# Altium schematic sheet MCU_and_Peripheral_Circuits.SchDoc: MCU & Peripheral Circuits
size 292 x 193 mm; SheetNumber: 7; SheetTotal: 12; SheetSize: A4
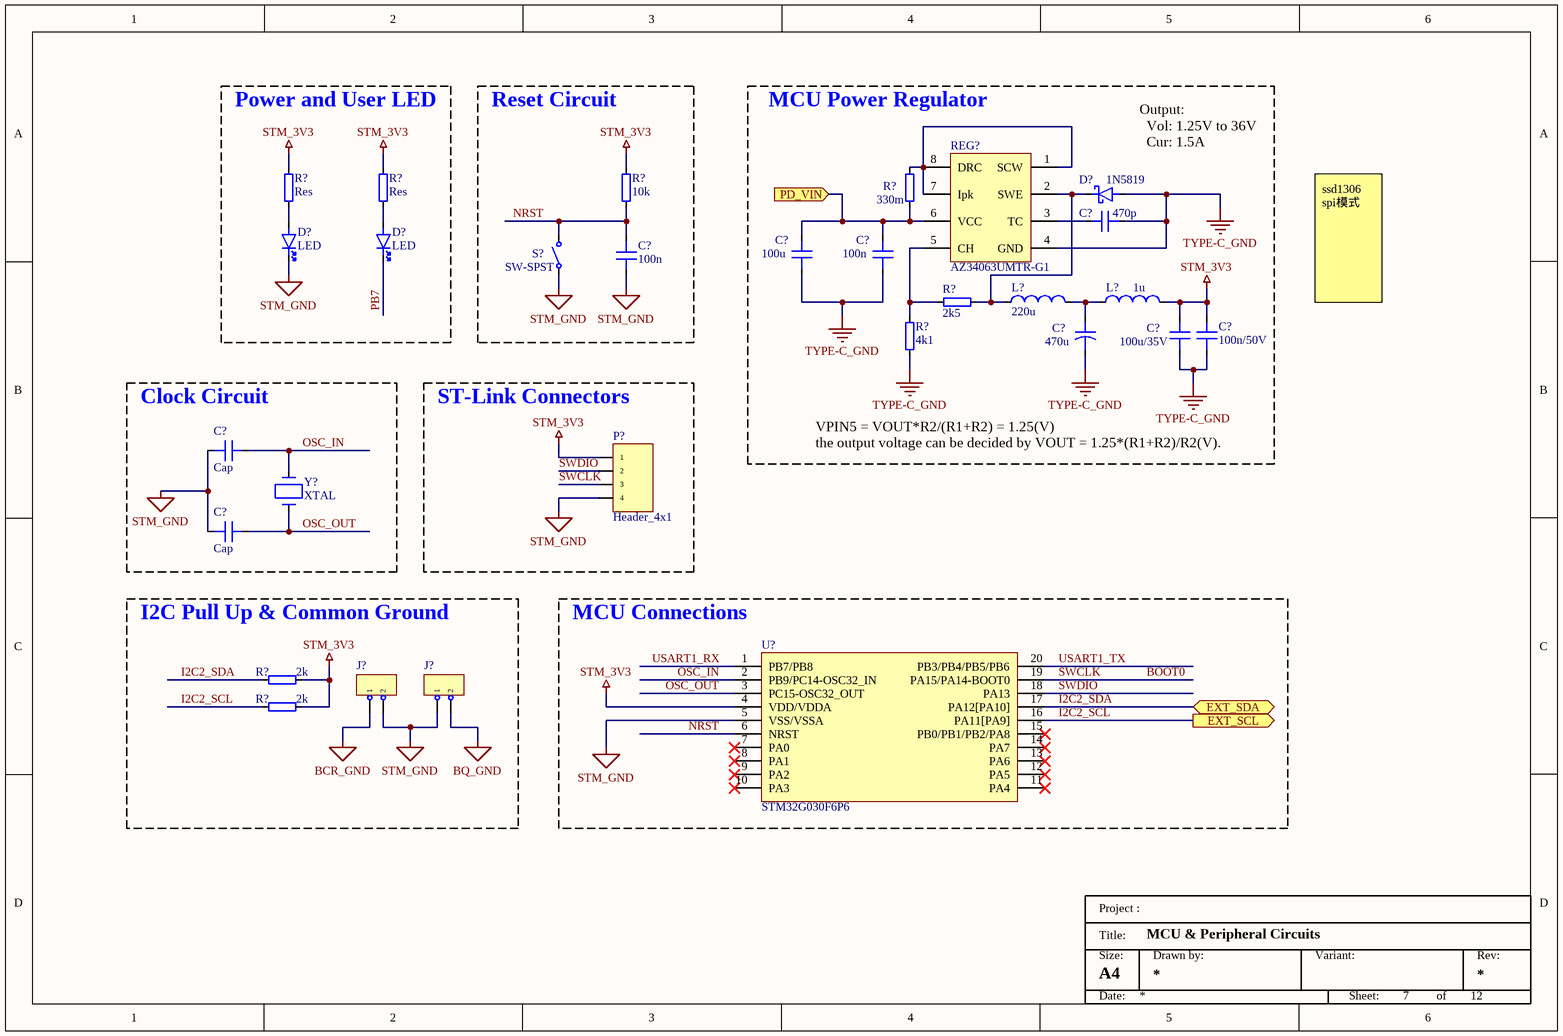
[diagram p0: MCU_and_Peripheral_Circuits.SchDoc]

## Parts
(Parts that share a designator on the sheet are numbered #1, #2 ... from top to bottom, then left to right.)
C?#1  470p  [0805_Cap]
C?#2  100u  [0805_Cap]
C?#3  100n  [0805_Cap]
C?#4  100n  [0805_Cap]
C?#5  470u
C?#6  100u/35V  [0805_Cap]
C?#7  100n/50V  [0805_Cap]
C?#8  Cap  [0805_Cap]
C?#9  Cap  [0805_Cap]
D?#1  1N5819
D?#2  LED  [0603_LED]
D?#3  LED  [0603_LED]
J?#1  Jumper_2x1  [Dupont_Header_(Female)_2.54_2x1]  (value not drawn)
J?#2  Jumper_2x1  [Dupont_Header_(Female)_2.54_2x1]  (value not drawn)
L?#1  220u  [1212_Ind]
L?#2  1u  [1212_Ind]
P?  Header_4x1  [XT60PW-M]
R?#1  330m  [0603_Res]
R?#2  Res  [0603_Res]
R?#3  Res  [0603_Res]
R?#4  10k  [0603_Res]
R?#5  2k5  [0603_Res]
R?#6  4k1  [0603_Res]
R?#7  2k  [0603_Res]
R?#8  2k  [0603_Res]
REG?  AZ34063UMTR-G1  [SOIC-8]
S?  SW-SPST
U?  STM32G030F6P6  [TSSOP-20]
Y?  XTAL

## Blocks framed on the sheet
Power and User LED: D?#2 D?#3 R?#2 R?#3
Reset Circuit: C?#4 R?#4 S?
MCU Power Regulator: C?#1-C?#3 C?#5-C?#7 D?#1 L?#1 L?#2 R?#1 R?#5 R?#6 REG?
Clock Circuit: C?#8 C?#9 Y?
ST-Link Connectors: P?
I2C Pull Up & Common Ground: J?#1 J?#2 R?#7 R?#8
MCU Connections: U?

## Ports
EXT_SCL (out), EXT_SDA (bidir), PD_VIN (in)

## Nets
BCR_GND: J?#1.1
BQ_GND: J?#2.2
STM_3V3: C?#6.1 C?#7.1 L?#2.2 P?.1 R?#2.2 R?#3.2 R?#4.2 R?#7.2 R?#8.2 U?.4(VDD/VDDA)
STM_GND: C?#4.1 C?#8.2 C?#9.2 D?#2.2(K) J?#1.2 J?#2.1 P?.4 S?.1 U?.5(VSS/VSSA)
TYPE-C_GND: C?#1.2 C?#2.2 C?#3.2 C?#5.2 C?#6.2 C?#7.2 D?#1.1(A) R?#6.1 REG?.4(GND)
BOOT0: P?.3 U?.19(PA15/PA14-BOOT0)  [also labelled SWCLK]
I2C2_SCL: R?#8.1 U?.16(PA11[PA9]) ; port EXT_SCL
I2C2_SDA: R?#7.1 U?.17(PA12[PA10]) ; port EXT_SDA
NRST: C?#4.2 R?#4.1 S?.2 U?.6(NRST)
OSC_IN: C?#8.1 U?.2(PB9/PC14-OSC32_IN) Y?.2
OSC_OUT: C?#9.1 U?.3(PC15-OSC32_OUT) Y?.1
PB7: D?#3.2(K)
PD_VIN: C?#2.1 C?#3.1 R?#1.2 REG?.6(VCC) ; port PD_VIN
SWDIO: P?.2 U?.18(PA13)
USART1_RX: U?.1(PB7/PB8)
USART1_TX: U?.20(PB3/PB4/PB5/PB6)
NetC?#1_1: C?#1.1 REG?.3(TC)
NetC?#5_1: C?#5.1 L?#1.2 L?#2.1
NetD?#1_2: D?#1.2(K) L?#1.1 R?#5.1 REG?.2(SWE)
NetD?#2_1: D?#2.1(A) R?#2.1
NetD?#3_1: D?#3.1(A) R?#3.1
NetR?#1_1: R?#1.1 REG?.1(SCW) REG?.7(Ipk) REG?.8(DRC)
NetR?#5_2: R?#5.2 R?#6.2 REG?.5(CH)

Not connected (* = marked no-connect by the designer): U? 7(PA0)* 8(PA1)* 9(PA2)* 10(PA3)* 11(PA4)* 12(PA5)* 13(PA6)* 14(PA7)* 15(PB0/PB1/PB2/PA8)*

## Notes on the sheet
- (near D?#1) Output:
  Vol: 1.25V to 36V
  Cur: 1.5A
- ssd1306 spi模式
- VPIN5 = VOUT*R2/(R1+R2) = 1.25(V)
  the output voltage can be decided by VOUT = 1.25*(R1+R2)/R2(V).
- Project :
- Size:
- Title:
- Drawn by:
- Variant:
- Rev:
- Date:
- Sheet:
- of

## Library data of the parts
C?#1-C?#4 C?#6-C?#9 = Cap: General capacitor (non-polarized); Mfr. #: *; Mfr.: *; Distributor_Link: *; Datasheet: *; Distributor #: *
C?#5 = Cap_2: General capacitor (with polarity); Mfr. #: *; Mfr.: *; Distributor_Link: *; Datasheet: *; Distributor #: *
D?#1 = Diode_Schottky: General schottky diode; Mfr. #: *; Mfr.: *; Distributor_Link: *; Datasheet: *; Distributor #: *
D?#2 D?#3 = LED: General LED; Mfr. #: *; Mfr.: *; Distributor_Link: *; Datasheet: *; Distributor #: *
J?#1 J?#2 = Jumper_2x1: General Jumper 2x1; Mfr. #: *; Mfr.: *; Distributor_Link: *; Datasheet: *; Distributor #: *
L?#1 L?#2 = Inductor: General Inductor; Mfr. #: *; Mfr.: *; Distributor_Link: *; Datasheet: *; Distributor #: *
P? = Header_4x1: General header 4x1; Mfr. #: *; Mfr.: *; Distributor_Link: *; Datasheet: *; Distributor #: *
R?#1-R?#8 = Res: General Resistor; Mfr. #: *; Mfr.: *; Distributor_Link: *; Datasheet: *; Distributor #: *
REG? = AZ34063UMTR-G1: USB Interface IC USB Type-C port controller (BCR) CYPD3177; Mfr.: Diodes Incorporated; Distributor_Link: https://www.mouser.tw/ProductDetail/Diodes-Incorporated/AZ34063UMTR-G1?qs=FKu9oBikfSmOGMlC%2Fa3O3g%3D%3D; Mfr. #: AZ34063UMTR-G1; Datasheet: https://www.diodes.com/assets/Datasheets/AZ34063U.pdf; Distributor #: 621-AZ34063UMTR-G1
S? = SW-SPST: General Single-Pole, Single-Throw Switch; Mfr. #: *; Mfr.: *; Distributor_Link: *; Datasheet: *; Distributor #: *
U? = STM32G030F6P6: ARM Microcontrollers - MCU Mainstream Value-Line Arm Cortex-M0+ MCU 32 Kbytes of Flash 8 Kbytes RAM, 64 MHz; Mfr.: STMicroelectronics; Distributor_Link: https://www.mouser.tw/ProductDetail/STMicroelectronics/STM32G030F6P6?qs=uwxL4vQweFOQRcVHghCbHA%3D%3D; Mfr. #: STM32G030F6P6; Datasheet: https://www.mouser.tw/datasheet/2/389/stm32g030c6-1826662.pdf; Distributor #: 511-STM32G030F6P6
Y? = XTAL: General Crystals; Mfr. #: *; Mfr.: *; Distributor_Link: *; Datasheet: *; Distributor #: *